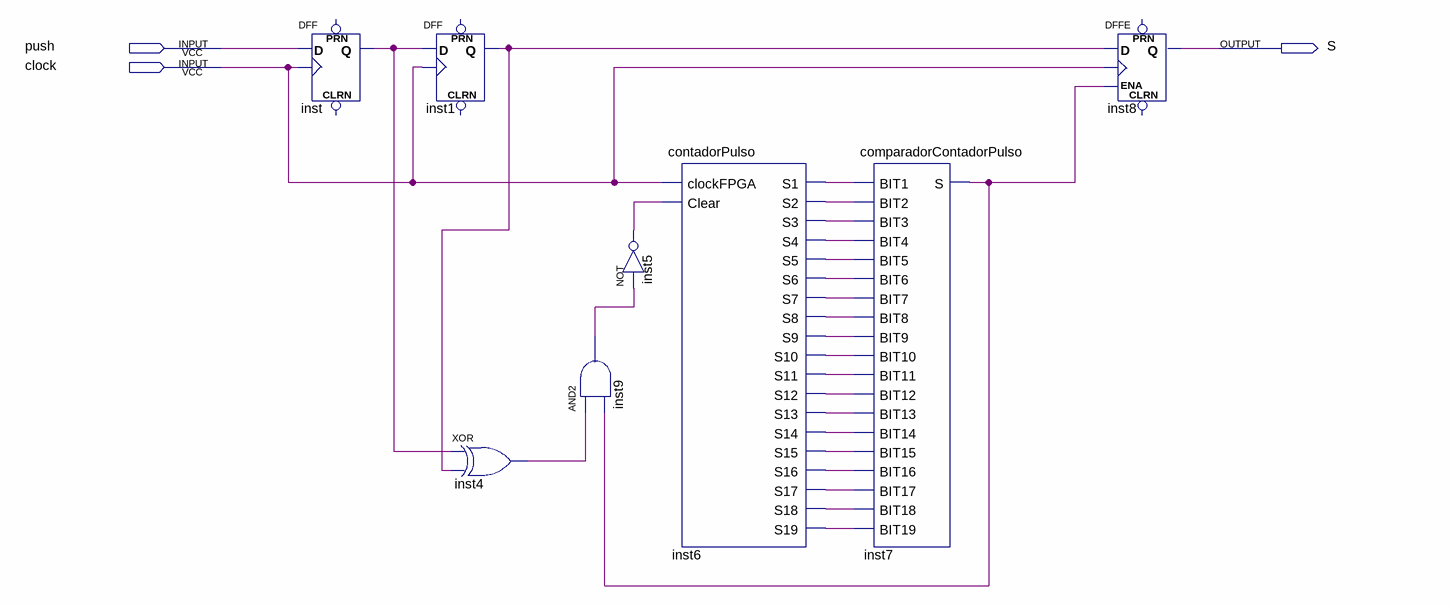
[diagram p0: schematic sheet]
// Quartus schematic debouncer.bdf as structural Verilog: 8 symbols, 3 pins
module debouncer (
  input  push,
  input  clock,
  output S
);

  wire inst1_q, inst4_out, inst5_out, inst6_s1, inst6_s2, inst6_s3, inst6_s4, inst6_s5, inst6_s6, inst6_s7,
       inst6_s8, inst6_s9, inst6_s10, inst6_s11, inst6_s12, inst6_s13, inst6_s14, inst6_s15, inst6_s16,
       inst6_s17, inst6_s18, inst6_s19, inst7_s, inst9_out, inst_q;

  DFF inst (.CLK(clock), .D(push), .Q(inst_q));  // open: CLRN, PRN
  DFF inst1 (.CLK(clock), .D(inst_q), .Q(inst1_q));  // open: CLRN, PRN
  xor inst4 (inst4_out, inst_q, inst1_q);
  not inst5 (inst5_out, inst9_out);
  and inst9 (inst9_out, inst4_out, inst7_s);
  contadorPulso inst6 (
    .clockFPGA(clock), .Clear(inst5_out), .S1(inst6_s1), .S2(inst6_s2), .S3(inst6_s3), .S4(inst6_s4),
    .S5(inst6_s5), .S6(inst6_s6), .S7(inst6_s7), .S8(inst6_s8), .S9(inst6_s9), .S10(inst6_s10),
    .S11(inst6_s11), .S12(inst6_s12), .S13(inst6_s13), .S14(inst6_s14), .S15(inst6_s15), .S16(inst6_s16),
    .S17(inst6_s17), .S18(inst6_s18), .S19(inst6_s19));
  comparadorContadorPulso inst7 (
    .BIT1(inst6_s1), .BIT2(inst6_s2), .BIT3(inst6_s3), .BIT4(inst6_s4), .BIT5(inst6_s5), .BIT6(inst6_s6),
    .BIT7(inst6_s7), .BIT8(inst6_s8), .BIT9(inst6_s9), .BIT10(inst6_s10), .BIT11(inst6_s11),
    .BIT12(inst6_s12), .BIT13(inst6_s13), .BIT14(inst6_s14), .BIT15(inst6_s15), .BIT16(inst6_s16),
    .BIT17(inst6_s17), .BIT18(inst6_s18), .BIT19(inst6_s19), .S(inst7_s));
  DFFE inst8 (.D(inst1_q), .CLK(clock), .ENA(inst7_s), .Q(S));  // open: PRN, CLRN
endmodule
